# Altium schematic sheet Booster_Block_Schematic.SchDoc: Booster block
size 420 x 297 mm; Author: G.K.; CompanyName: WUT; DrawnBy: G.K.; Organization: WUT ISE; Address1: Warsaw Univeristy of Technology; Address2: Nowowiejska 15/19; DocumentNumber: 1; Revision: -; SheetNumber: 1; SheetTotal: 6; EDA_Number: ARTIQ; Projet: Booster RF Power Amplifier; ModifiedBy: -; CreateDate: XX/XX/XXXX; CheckedDate: -; Title2: schematic; DivGrp: ISE; Designer: G.K.; ModifiedDate: -; ProjectName: Booster RF Power Amplifier
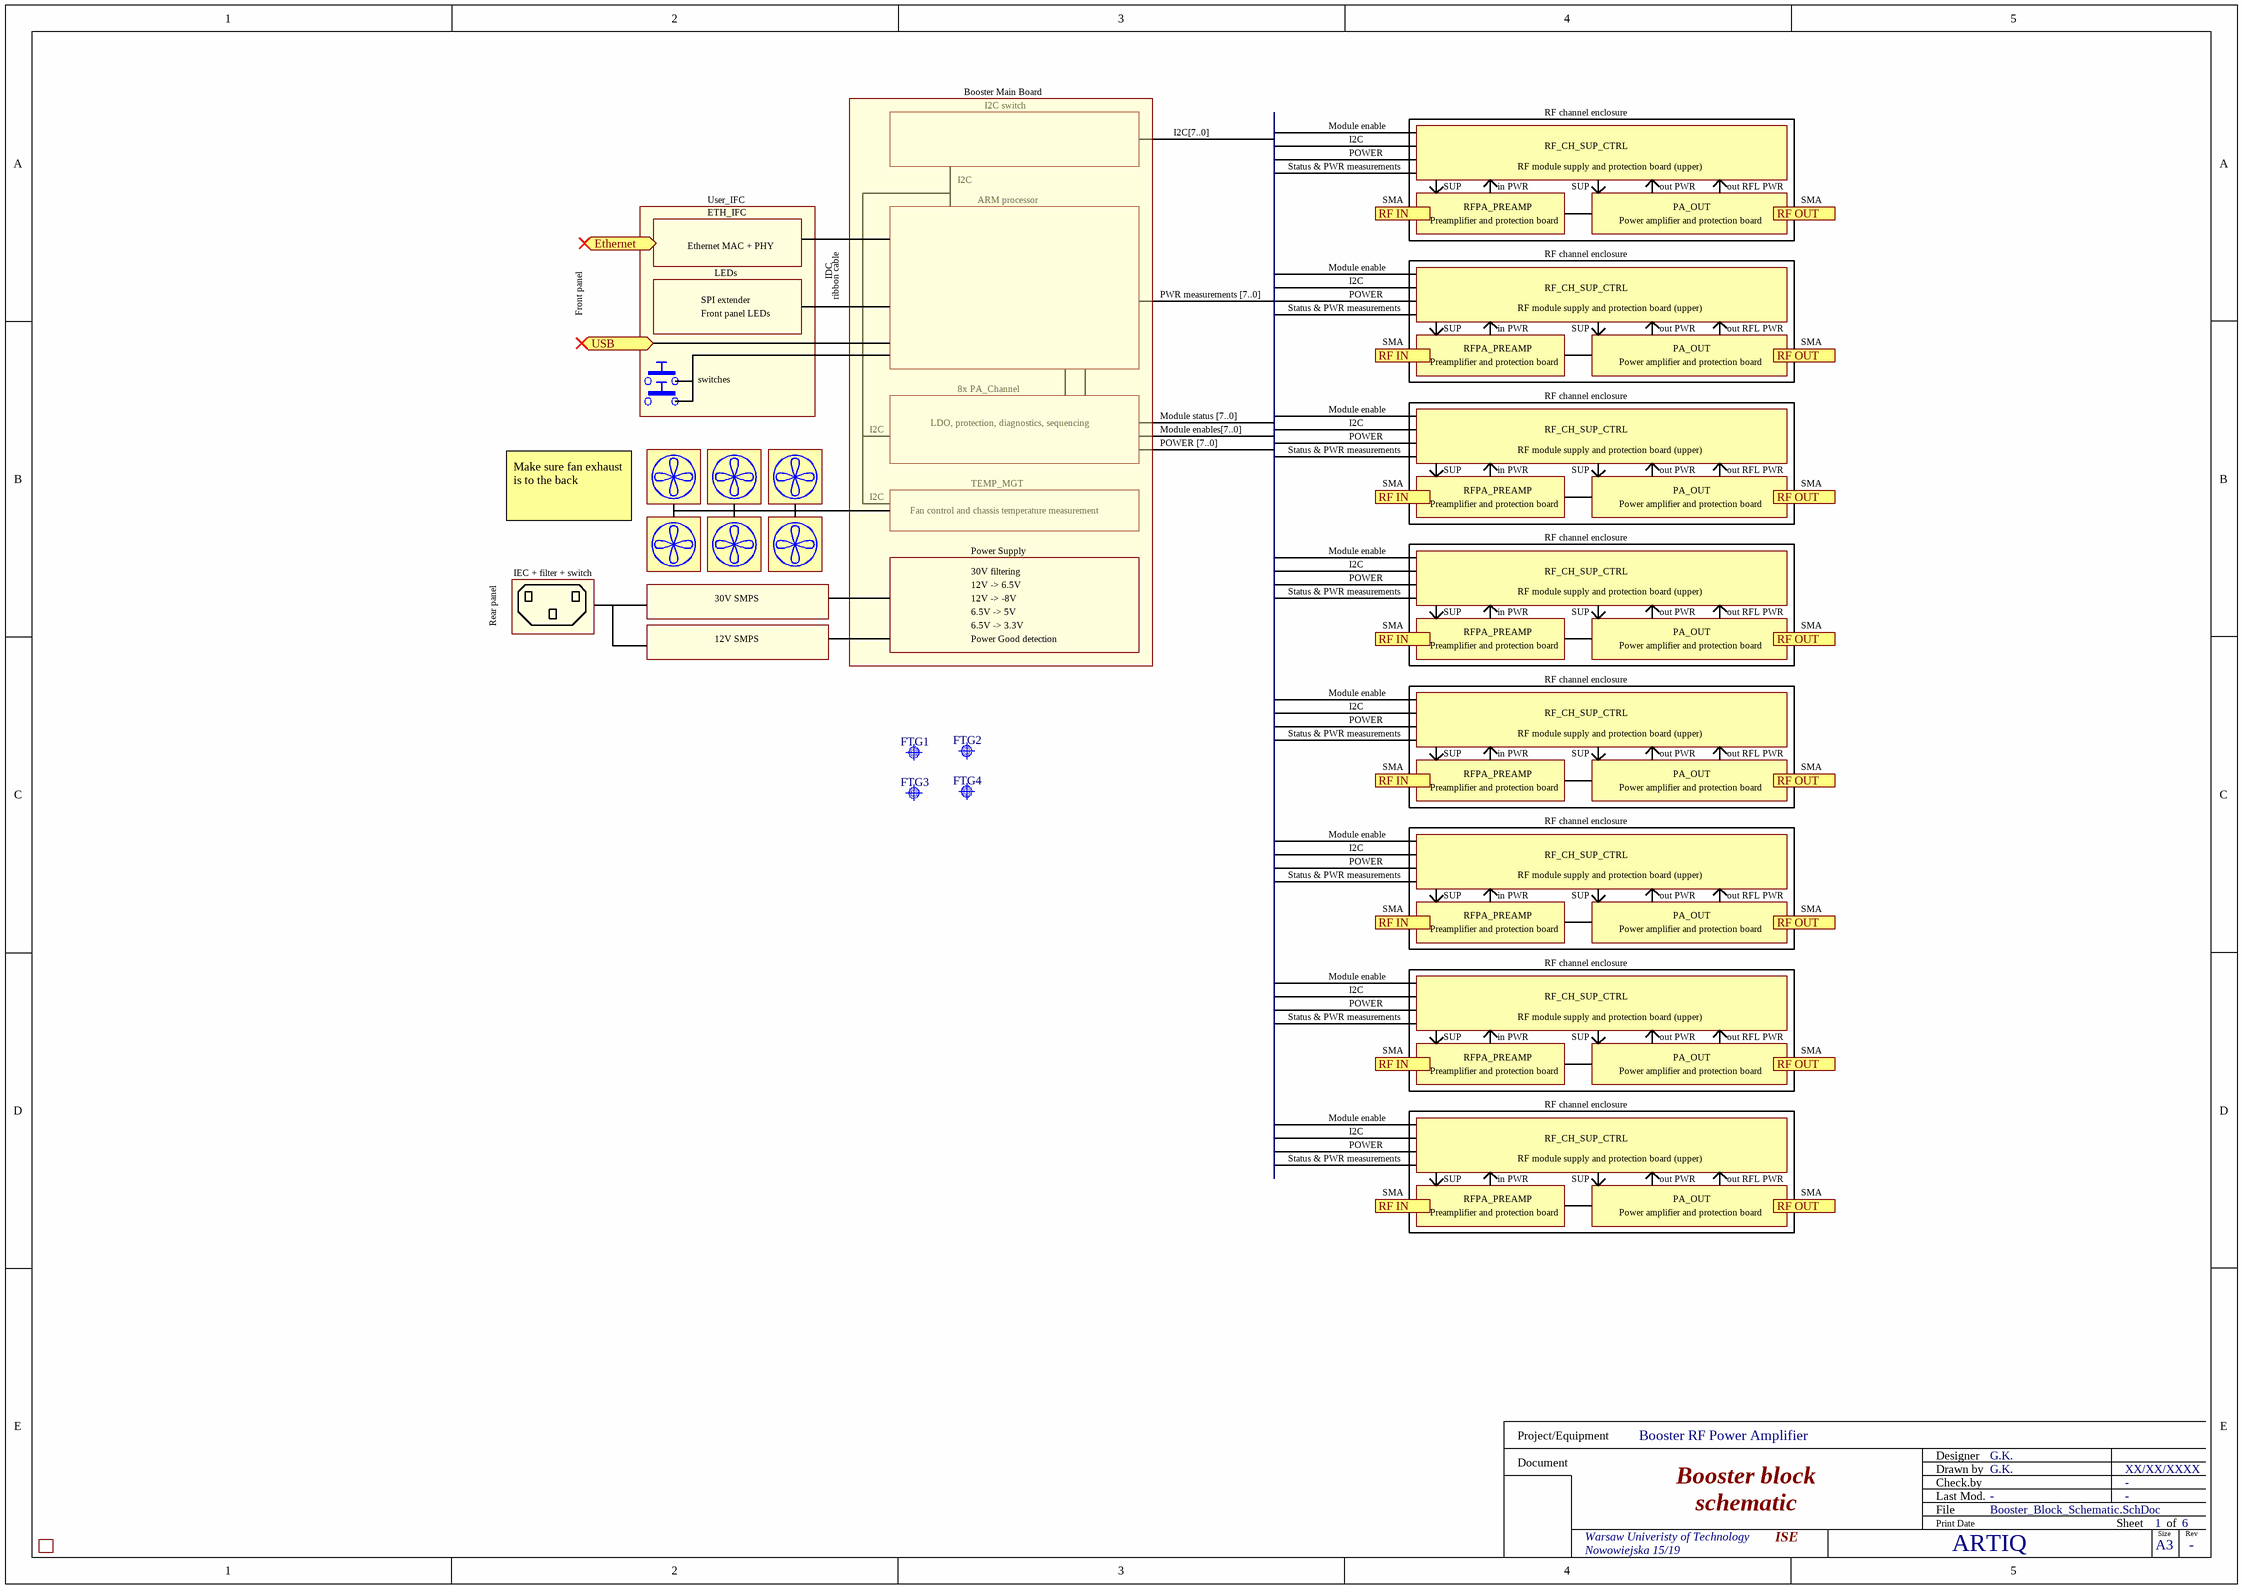
[diagram p0: Booster_Block_Schematic.SchDoc]

## Parts
FTG1  Use only in PCB  [FIDUCIAL_TOP_C100-200]  (value not drawn)  (no BOM)
FTG2  Use only in PCB  [FIDUCIAL_TOP_C100-200]  (value not drawn)  (no BOM)
FTG3  Use only in PCB  [FIDUCIAL_TOP_S100-200]  (value not drawn)  (no BOM)
FTG4  Use only in PCB  [FIDUCIAL_TOP_S100-200]  (value not drawn)  (no BOM)

## Sub-sheets
U_Booster_TOP = Booster_Main_Board.SchDoc: no entries

## Ports
Ethernet (bidir), RF IN (out), RF OUT (out), USB (bidir)

## Notes on the sheet
- Booster Main Board
- I2C switch
- Module enable
- RF channel enclosure
- I2C
- I2C[7..0]
- Status & PWR measurements
- POWER
- SUP
- in PWR
- RF module supply and protection board (upper)
- RF_CH_SUP_CTRL
- out PWR
- out RFL PWR
- Ethernet MAC + PHY
- ETH_IFC
- User_IFC
- ARM processor
- SMA
- Preamplifier and protection board
- RFPA_PREAMP
- Power amplifier and protection board
- PA_OUT
- Front panel
- SPI extender
- Front panel LEDs
- LEDs
- IDC
- ribbon cable
- PWR measurements [7..0]
- switches
- 8x PA_Channel
- LDO, protection, diagnostics, sequencing
- Module enables[7..0]
- Module status [7..0]
- POWER [7..0]
- Make sure fan exhaust is to the back
- Fan control and chassis temperature measurement
- TEMP_MGT
- IEC + filter + switch
- Power Supply
- 30V filtering
- 12V -> 6.5V
- Rear panel
- 30V SMPS
- 12V SMPS
- 12V -> -8V
- 6.5V -> 5V
- 6.5V -> 3.3V
- Power Good detection
- Project/Equipment
- Document
- Designer
- Drawn by
- Check.by
- File
- Last Mod.
- Print Date
- Sheet
- Size
- A3
- of
- Rev

## Library data of the parts
FTG1 FTG2 = FIDUCIAL_TARGET_C100-200: Fiducial Target; Part Description: Round Fiducial Target, Top Layer, 1.0mm, Top Solder 2.0mm, Keepout =2.0mm; Mounted: No; Part Number: FIDUCIAL_TARGET_C100-200; Component Type: Standard (No BOM); Pin Count: 1; Family: Fiducial; Socket: No; SMD: Yes; Sense: No; Status: None; ComponentHeight: 0mm; HelpURL: Undefined; Author: CERN DEM JLC; CreateDate: 09.02.2010; LatestRevisionDate: 04.04.2012; PackageDescription: Round Fiducial Target, Top Layer, 1.0mm, Top Solder 2.0mm, Keepout =2.0mm
FTG3 FTG4 = FIDUCIAL_TARGET_S100-200: Fiducial Target; Part Description: Square Fiducial Target, Top Layer, 1.0mm, Top Solder 2.0mm, Keepout =2.0mm; Mounted: No; Part Number: FIDUCIAL_TARGET_S100-200; Component Type: Standard (No BOM); Pin Count: 1; Family: Fiducial; Socket: No; SMD: Yes; Sense: No; Status: None; ComponentHeight: 0mm; HelpURL: Undefined; Author: CERN DEM JLC; CreateDate: 09.02.2010; LatestRevisionDate: 04.04.2012; PackageDescription: Square Fiducial Target, Top Layer, 1.0mm, Top Solder 2.0mm, Keepout =2.0mm